# Altium schematic sheet emitter.SchDoc
size A4
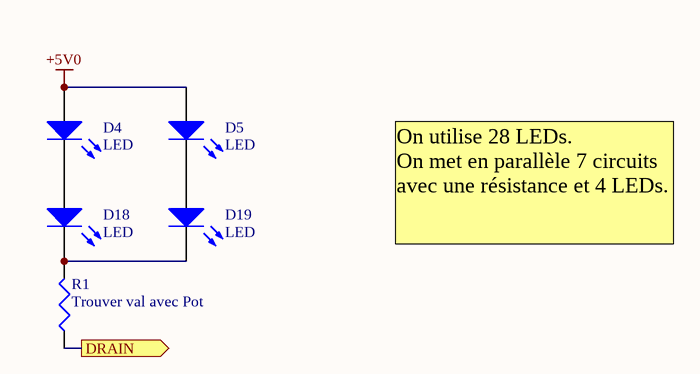
[diagram p0: emitter.SchDoc]

## Parts
D4  LED  [LED 5MM Horiz]
D5  LED  [LED 5MM Horiz]
D18  LED  [LED 5MM Horiz]
D19  LED  [LED 5MM Horiz]
R1  value Trouver val avec Pot  [AXIAL0.8 Vert]  (hidden comment: RES)

## Ports
DRAIN (out)

## Nets
+5V0: D4.A D5.A
DRAIN: R1.1 ; port DRAIN
NetD4_K: D4.K D18.A
NetD5_K: D5.K D19.A
NetD18_K: D18.K D19.K R1.2

## Notes on the sheet
- On utilise 28 LEDs.
  On met en parallèle 7 circuits avec une résistance et 4 LEDs.

## Library data of the parts
D4 D5 D18 D19 = LED: Typical RED, GREEN, YELLOW, AMBER GaAs LED; Published: 8-Jun-2000; LatestRevisionDate: 17-Jul-2002; LatestRevisionNote: Re-released for DXP Platform.; PackageVersion: Feb-2002; PackageReference: 3.2X1.6X1.1; Publisher: Altium Limited; PackageDescription: SM LED; 2 Flat Leads
R1 = RES: Resistor; Published: 8-Jun-2000; LatestRevisionDate: 29-May-2009; LatestRevisionNote: IPC-7351 Footprint Added.; PackageReference: J1-0603; Publisher: Altium Limited; PackageDescription: Chip Resistor